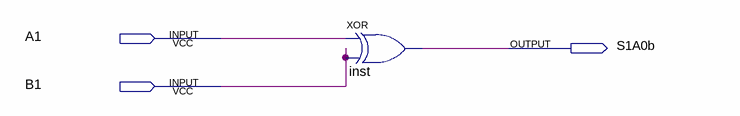
[diagram p0: schematic sheet]
// Quartus schematic S1A0b.bdf as structural Verilog: 1 symbols, 3 pins
module S1A0b (
  input  A1,
  input  B1,
  output S1A0b
);

  xor inst (S1A0b, A1, B1);
endmodule
